# Altium schematic sheet Sheet_1_2025-11-26.schdoc
size 164 x 179 mm
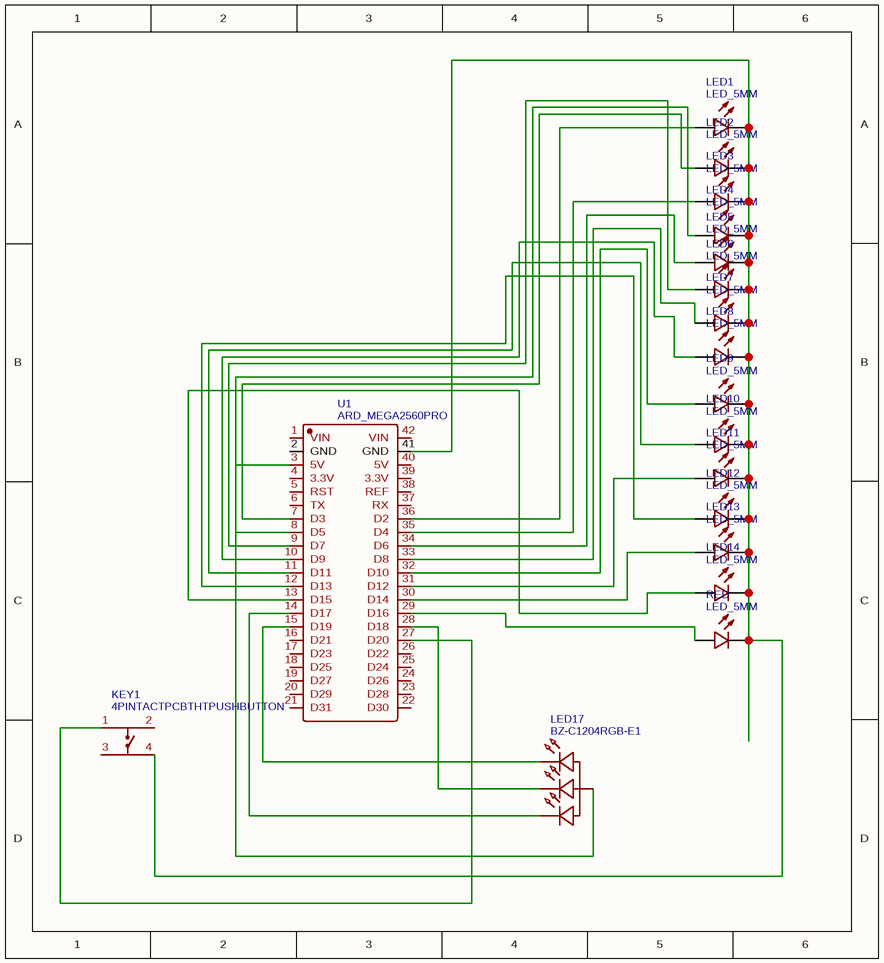
[diagram p0: Sheet_1_2025-11-26.schdoc]

## Parts
KEY1  4PINTACTPCBTHTPUSHBUTTON  [SW-SMD_4P-L6.0-W6.0-P4.50-LS10.0_TL3301EF160QG]
LED1  LED_5MM  [LED-TH_BD5.0-P2.54-FD_C9900023552]
LED2  LED_5MM  [LED-TH_BD5.0-P2.54-FD_C9900023552]
LED3  LED_5MM  [LED-TH_BD5.0-P2.54-FD_C9900023552]
LED4  LED_5MM  [LED-TH_BD5.0-P2.54-FD_C9900023552]
LED5  LED_5MM  [LED-TH_BD5.0-P2.54-FD_C9900023552]
LED6  LED_5MM  [LED-TH_BD5.0-P2.54-FD_C9900023552]
LED7  LED_5MM  [LED-TH_BD5.0-P2.54-FD_C9900023552]
LED8  LED_5MM  [LED-TH_BD5.0-P2.54-FD_C9900023552]
LED9  LED_5MM  [LED-TH_BD5.0-P2.54-FD_C9900023552]
LED10  LED_5MM  [LED-TH_BD5.0-P2.54-FD_C9900023552]
LED11  LED_5MM  [LED-TH_BD5.0-P2.54-FD_C9900023552]
LED12  LED_5MM  [LED-TH_BD5.0-P2.54-FD_C9900023552]
LED13  LED_5MM  [LED-TH_BD5.0-P2.54-FD_C9900023552]
LED14  LED_5MM  [LED-TH_BD5.0-P2.54-FD_C9900023552]
LED17  BZ-C1204RGB-E1  [LED-SMD_4P-L3.2-W1.5_LED_RGB]
RED  LED_5MM  [LED-TH_BD5.0-P2.54-FD_C9900023552]
U1  ARD_MEGA2560PRO  [COMM-SMD_L54.0-W38.0-P2.54_ARD_MEGA2560PRO]

## Nets
NetKEY1_1: KEY1.1 U1.27(D20)
NetKEY1_4: KEY1.4 LED1.2(K) LED2.2(K) LED3.2(K) LED4.2(K) LED5.2(K) LED6.2(K) LED7.2(K) LED8.2(K) LED9.2(K) LED10.2(K) LED11.2(K) LED12.2(K) LED13.2(K) LED14.2(K) RED.2(K) U1.41(GND)
NetLED1_1: LED1.1(A) U1.36(D2)
NetLED2_1: LED2.1(A) U1.7(D3)
NetLED3_1: LED3.1(A) U1.35(D4)
NetLED4_1: LED4.1(A) LED17.3 U1.3(5V) U1.8(D5)
NetLED5_1: LED5.1(A) U1.34(D6)
NetLED6_1: LED6.1(A) U1.9(D7)
NetLED7_1: LED7.1(A) U1.33(D8)
NetLED8_1: LED8.1(A) U1.10(D9)
NetLED9_1: LED9.1(A) U1.32(D10)
NetLED10_1: LED10.1(A) U1.11(D11)
NetLED11_1: LED11.1(A) U1.31(D12)
NetLED12_1: LED12.1(A) U1.12(D13)
NetLED13_1: LED13.1(A) U1.30(D14)
NetLED14_1: LED14.1(A) U1.13(D15)
NetLED17_1: LED17.1 U1.15(D19)
NetLED17_2: LED17.2 U1.28(D18)
NetLED17_4: LED17.4 U1.14(D17)
NetRED_1: RED.1(A) U1.29(D16)

Not connected (* = marked no-connect by the designer): KEY1 2 3; U1 1(VIN) 2(GND) 4(3.3V) 5(RST) 6(TX) 16(D21) 17(D23) 18(D25) 19(D27) 20(D29) 21(D31) 22(D30) 23(D28) 24(D26) 25(D24) 26(D22) 37(RX) 38(REF) 39(3.3V) 40(5V) 42(VIN)

## Library data of the parts
KEY1 = 4PINTACTPCBTHTPUSHBUTTON: Manufacturer: null; Contributor: LCSC; Supplier: LCSC; Supplier Part: C9900003768; Manufacturer Part: 4pinTACTPCBTHTPushButton; JLCPCB Part Class: Extended Part; spicePre: K; spiceSymbolName: 4PINTACTPCBTHTPUSHBUTTON
LED1-LED14 RED = LED_5MM: Manufacturer: null; Contributor: lcsc; Supplier: LCSC; Supplier Part: C9900023552; Manufacturer Part: LED_5MM; JLCPCB Part Class: Extended Part; spicePre: L; spiceSymbolName: LED_5MM
LED17 = BZ-C1204RGB-E1: Manufacturer: baizou(百洲); Contributor: lcsc; Supplier: LCSC; Supplier Part: C5357306; Manufacturer Part: BZ-C1204RGB-E1; JLCPCB Part Class: Extended Part; spicePre: L; spiceSymbolName: BZ-C1204RGB-E1
U1 = ARD_MEGA2560PRO: Manufacturer: null; subpart_no: 1; Supplier: LCSC; Supplier Part: C9900135944; Manufacturer Part: ARD_MEGA2560PRO; spicePre: U; spiceSymbolName: ARD_MEGA2560PRO